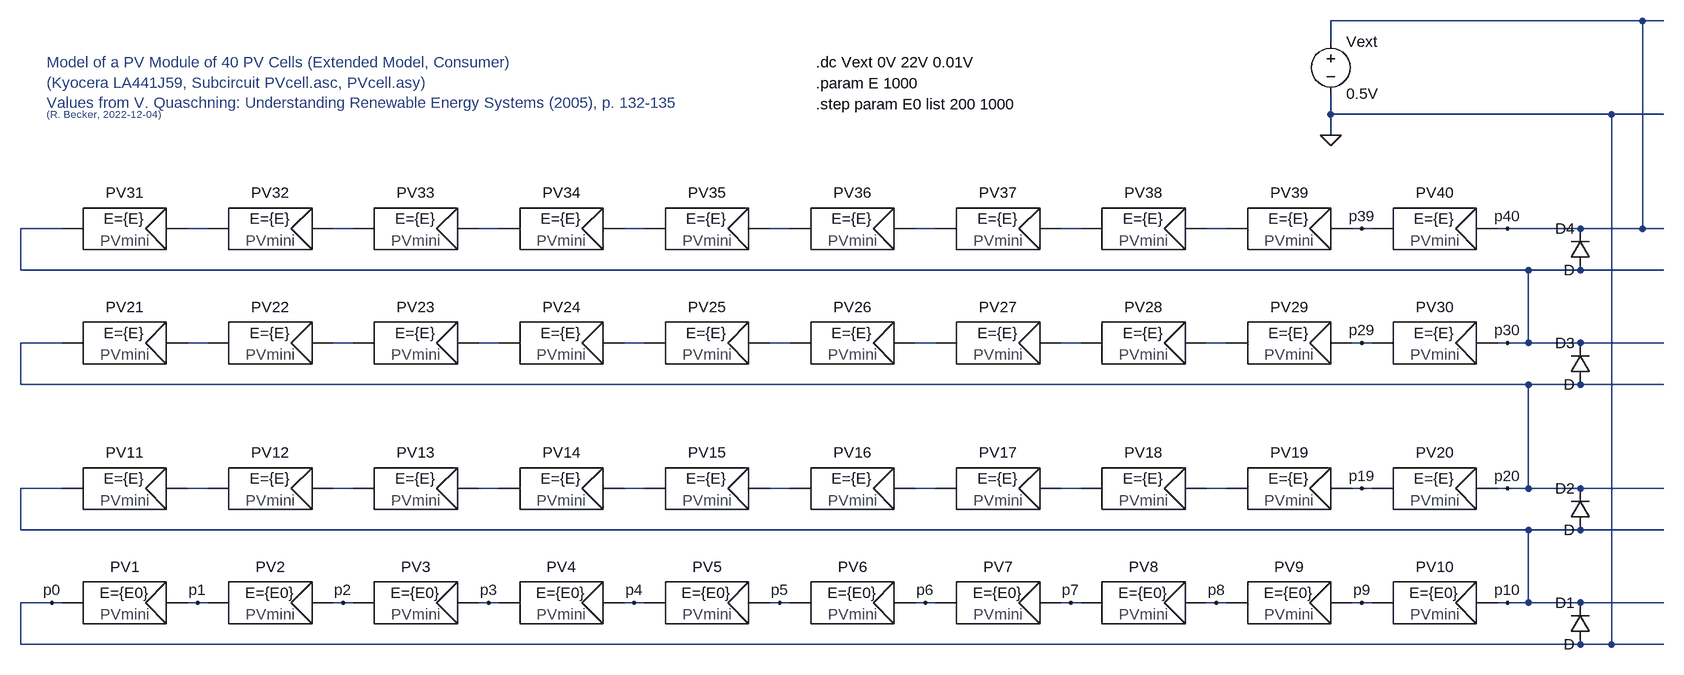
[diagram p0: schematic PVmodule_40_PVcell_Ext_Mini_V002.asc]
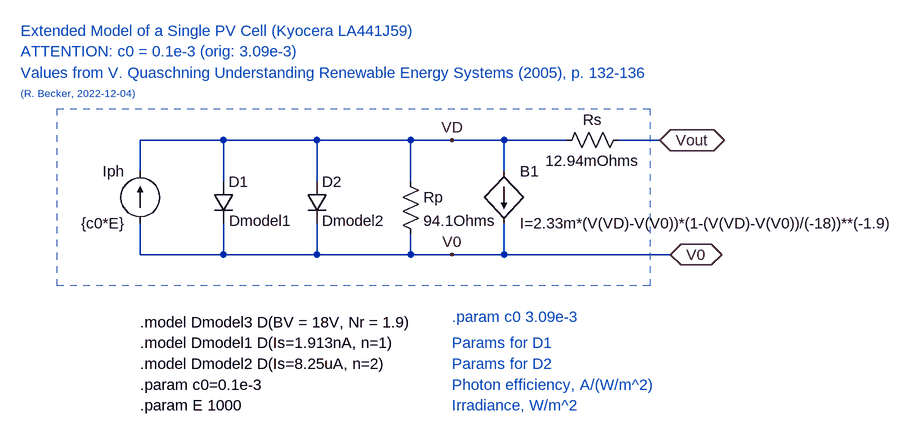
[diagram p1: sub-circuit pvcell_ext_mini.asc]
PVmodule_40_PVcell_Ext_Mini_V002.asc, the LTspice schematic file:
Version 4
SHEET 1 2048 1588
WIRE 1920 -16 1440 -16
WIRE 1952 -16 1920 -16
WIRE 1440 16 1440 -16
WIRE 1440 128 1440 96
WIRE 1872 128 1440 128
WIRE 1952 128 1872 128
WIRE 1440 160 1440 128
WIRE -512 304 -576 304
WIRE -288 304 -320 304
WIRE -64 304 -96 304
WIRE 160 304 128 304
WIRE 384 304 352 304
WIRE 608 304 576 304
WIRE 832 304 800 304
WIRE 1056 304 1024 304
WIRE 1280 304 1248 304
WIRE 1488 304 1472 304
WIRE 1504 304 1488 304
WIRE 1712 304 1696 304
WIRE 1824 304 1712 304
WIRE 1920 304 1920 -16
WIRE 1920 304 1824 304
WIRE 1952 304 1920 304
WIRE -576 368 -576 304
WIRE 1744 368 -576 368
WIRE 1824 368 1744 368
WIRE 1952 368 1824 368
WIRE -512 480 -576 480
WIRE -288 480 -320 480
WIRE -64 480 -96 480
WIRE 160 480 128 480
WIRE 384 480 352 480
WIRE 608 480 576 480
WIRE 832 480 800 480
WIRE 1056 480 1024 480
WIRE 1280 480 1248 480
WIRE 1488 480 1472 480
WIRE 1504 480 1488 480
WIRE 1712 480 1696 480
WIRE 1744 480 1744 368
WIRE 1744 480 1712 480
WIRE 1824 480 1744 480
WIRE 1952 480 1824 480
WIRE -576 544 -576 480
WIRE 1744 544 -576 544
WIRE 1824 544 1744 544
WIRE 1952 544 1824 544
WIRE -512 704 -576 704
WIRE -288 704 -320 704
WIRE -64 704 -96 704
WIRE 160 704 128 704
WIRE 384 704 352 704
WIRE 608 704 576 704
WIRE 832 704 800 704
WIRE 1056 704 1024 704
WIRE 1280 704 1248 704
WIRE 1488 704 1472 704
WIRE 1504 704 1488 704
WIRE 1712 704 1696 704
WIRE 1744 704 1744 544
WIRE 1744 704 1712 704
WIRE 1824 704 1744 704
WIRE 1952 704 1824 704
WIRE -576 768 -576 704
WIRE 1744 768 -576 768
WIRE 1824 768 1744 768
WIRE 1952 768 1824 768
WIRE -528 880 -576 880
WIRE -512 880 -528 880
WIRE -304 880 -320 880
WIRE -288 880 -304 880
WIRE -80 880 -96 880
WIRE -64 880 -80 880
WIRE 144 880 128 880
WIRE 160 880 144 880
WIRE 368 880 352 880
WIRE 384 880 368 880
WIRE 592 880 576 880
WIRE 608 880 592 880
WIRE 816 880 800 880
WIRE 832 880 816 880
WIRE 1040 880 1024 880
WIRE 1056 880 1040 880
WIRE 1264 880 1248 880
WIRE 1280 880 1264 880
WIRE 1488 880 1472 880
WIRE 1504 880 1488 880
WIRE 1712 880 1696 880
WIRE 1744 880 1744 768
WIRE 1744 880 1712 880
WIRE 1824 880 1744 880
WIRE 1952 880 1824 880
WIRE -576 944 -576 880
WIRE 1824 944 -576 944
WIRE 1872 944 1872 128
WIRE 1872 944 1824 944
WIRE 1952 944 1872 944
FLAG 1440 160 0
FLAG -528 880 p0
FLAG -304 880 p1
FLAG -80 880 p2
FLAG 144 880 p3
FLAG 368 880 p4
FLAG 592 880 p5
FLAG 816 880 p6
FLAG 1040 880 p7
FLAG 1264 880 p8
FLAG 1488 880 p9
FLAG 1712 880 p10
FLAG 1488 704 p19
FLAG 1712 704 p20
FLAG 1712 480 p30
FLAG 1712 304 p40
FLAG 1488 480 p29
FLAG 1488 304 p39
SYMBOL voltage 1440 0 R0
WINDOW 123 0 0 Left 2
WINDOW 39 0 0 Left 2
SYMATTR InstName Vext
SYMATTR Value 0.5V
SYMBOL diode 1840 944 R180
WINDOW 0 24 64 Left 2
WINDOW 3 24 0 Left 2
SYMATTR InstName D1
SYMBOL diode 1840 768 R180
WINDOW 0 24 64 Left 2
WINDOW 3 24 0 Left 2
SYMATTR InstName D2
SYMBOL diode 1840 544 R180
WINDOW 0 24 64 Left 2
WINDOW 3 24 0 Left 2
SYMATTR InstName D3
SYMBOL diode 1840 368 R180
WINDOW 0 24 64 Left 2
WINDOW 3 24 0 Left 2
SYMATTR InstName D4
SYMBOL pvcell_ext_mini -416 880 R0
WINDOW 39 -1 0 Bottom 2
SYMATTR SpiceLine E={E0}
SYMATTR InstName PV1
SYMBOL pvcell_ext_mini -192 880 R0
WINDOW 39 -1 0 Bottom 2
SYMATTR SpiceLine E={E0}
SYMATTR InstName PV2
SYMBOL pvcell_ext_mini 32 880 R0
WINDOW 39 -1 0 Bottom 2
SYMATTR SpiceLine E={E0}
SYMATTR InstName PV3
SYMBOL pvcell_ext_mini 256 880 R0
WINDOW 39 -1 0 Bottom 2
SYMATTR SpiceLine E={E0}
SYMATTR InstName PV4
SYMBOL pvcell_ext_mini 480 880 R0
WINDOW 39 -1 0 Bottom 2
SYMATTR SpiceLine E={E0}
SYMATTR InstName PV5
SYMBOL pvcell_ext_mini 704 880 R0
WINDOW 39 -1 0 Bottom 2
SYMATTR SpiceLine E={E0}
SYMATTR InstName PV6
SYMBOL pvcell_ext_mini 928 880 R0
WINDOW 39 -1 0 Bottom 2
SYMATTR SpiceLine E={E0}
SYMATTR InstName PV7
SYMBOL pvcell_ext_mini 1152 880 R0
WINDOW 39 -1 0 Bottom 2
SYMATTR SpiceLine E={E0}
SYMATTR InstName PV8
SYMBOL pvcell_ext_mini 1376 880 R0
WINDOW 39 -1 0 Bottom 2
SYMATTR SpiceLine E={E0}
SYMATTR InstName PV9
SYMBOL pvcell_ext_mini 1600 880 R0
WINDOW 39 -1 0 Bottom 2
SYMATTR SpiceLine E={E0}
SYMATTR InstName PV10
SYMBOL pvcell_ext_mini -416 704 R0
WINDOW 39 -1 0 Bottom 2
SYMATTR SpiceLine E={E}
SYMATTR InstName PV11
SYMBOL pvcell_ext_mini -192 704 R0
WINDOW 39 -1 0 Bottom 2
SYMATTR SpiceLine E={E}
SYMATTR InstName PV12
SYMBOL pvcell_ext_mini 32 704 R0
WINDOW 39 -1 0 Bottom 2
SYMATTR SpiceLine E={E}
SYMATTR InstName PV13
SYMBOL pvcell_ext_mini 256 704 R0
WINDOW 39 -1 0 Bottom 2
SYMATTR SpiceLine E={E}
SYMATTR InstName PV14
SYMBOL pvcell_ext_mini 480 704 R0
WINDOW 39 -1 0 Bottom 2
SYMATTR SpiceLine E={E}
SYMATTR InstName PV15
SYMBOL pvcell_ext_mini 704 704 R0
WINDOW 39 -1 0 Bottom 2
SYMATTR SpiceLine E={E}
SYMATTR InstName PV16
SYMBOL pvcell_ext_mini 928 704 R0
WINDOW 39 -1 0 Bottom 2
SYMATTR SpiceLine E={E}
SYMATTR InstName PV17
SYMBOL pvcell_ext_mini 1152 704 R0
WINDOW 39 -1 0 Bottom 2
SYMATTR SpiceLine E={E}
SYMATTR InstName PV18
SYMBOL pvcell_ext_mini 1376 704 R0
WINDOW 39 -1 0 Bottom 2
SYMATTR SpiceLine E={E}
SYMATTR InstName PV19
SYMBOL pvcell_ext_mini 1600 704 R0
WINDOW 39 -1 0 Bottom 2
SYMATTR SpiceLine E={E}
SYMATTR InstName PV20
SYMBOL pvcell_ext_mini -416 480 R0
WINDOW 39 -1 0 Bottom 2
SYMATTR SpiceLine E={E}
SYMATTR InstName PV21
SYMBOL pvcell_ext_mini -192 480 R0
WINDOW 39 -1 0 Bottom 2
SYMATTR SpiceLine E={E}
SYMATTR InstName PV22
SYMBOL pvcell_ext_mini 32 480 R0
WINDOW 39 -1 0 Bottom 2
SYMATTR SpiceLine E={E}
SYMATTR InstName PV23
SYMBOL pvcell_ext_mini 256 480 R0
WINDOW 39 -1 0 Bottom 2
SYMATTR SpiceLine E={E}
SYMATTR InstName PV24
SYMBOL pvcell_ext_mini 480 480 R0
WINDOW 39 -1 0 Bottom 2
SYMATTR SpiceLine E={E}
SYMATTR InstName PV25
SYMBOL pvcell_ext_mini 704 480 R0
WINDOW 39 -1 0 Bottom 2
SYMATTR SpiceLine E={E}
SYMATTR InstName PV26
SYMBOL pvcell_ext_mini 928 480 R0
WINDOW 39 -1 0 Bottom 2
SYMATTR SpiceLine E={E}
SYMATTR InstName PV27
SYMBOL pvcell_ext_mini 1152 480 R0
WINDOW 39 -1 0 Bottom 2
SYMATTR SpiceLine E={E}
SYMATTR InstName PV28
SYMBOL pvcell_ext_mini 1376 480 R0
WINDOW 39 -1 0 Bottom 2
SYMATTR SpiceLine E={E}
SYMATTR InstName PV29
SYMBOL pvcell_ext_mini 1600 480 R0
WINDOW 39 -1 0 Bottom 2
SYMATTR SpiceLine E={E}
SYMATTR InstName PV30
SYMBOL pvcell_ext_mini -416 304 R0
WINDOW 39 -1 0 Bottom 2
SYMATTR SpiceLine E={E}
SYMATTR InstName PV31
SYMBOL pvcell_ext_mini -192 304 R0
WINDOW 39 -1 0 Bottom 2
SYMATTR SpiceLine E={E}
SYMATTR InstName PV32
SYMBOL pvcell_ext_mini 32 304 R0
WINDOW 39 -1 0 Bottom 2
SYMATTR SpiceLine E={E}
SYMATTR InstName PV33
SYMBOL pvcell_ext_mini 256 304 R0
WINDOW 39 -1 0 Bottom 2
SYMATTR SpiceLine E={E}
SYMATTR InstName PV34
SYMBOL pvcell_ext_mini 480 304 R0
WINDOW 39 -1 0 Bottom 2
SYMATTR SpiceLine E={E}
SYMATTR InstName PV35
SYMBOL pvcell_ext_mini 704 304 R0
WINDOW 39 -1 0 Bottom 2
SYMATTR SpiceLine E={E}
SYMATTR InstName PV36
SYMBOL pvcell_ext_mini 928 304 R0
WINDOW 39 -1 0 Bottom 2
SYMATTR SpiceLine E={E}
SYMATTR InstName PV37
SYMBOL pvcell_ext_mini 1152 304 R0
WINDOW 39 -1 0 Bottom 2
SYMATTR SpiceLine E={E}
SYMATTR InstName PV38
SYMBOL pvcell_ext_mini 1376 304 R0
WINDOW 39 -1 0 Bottom 2
SYMATTR SpiceLine E={E}
SYMATTR InstName PV39
SYMBOL pvcell_ext_mini 1600 304 R0
WINDOW 39 -1 0 Bottom 2
SYMATTR SpiceLine E={E}
SYMATTR InstName PV40
TEXT 648 48 Left 2 !.dc Vext 0V 22V 0.01V
TEXT 648 112 Left 2 !.step param E0 list 200 1000
TEXT -536 48 Left 2 ;Model of a PV Module of 40 PV Cells (Extended Model, Consumer) \n(Kyocera LA441J59, Subcircuit PVcell.asc, PVcell.asy)\nValues from V. Quaschning: Understanding Renewable Energy Systems (2005), p. 132-135
TEXT -536 128 Left 1 ;(R. Becker, 2022-12-04)
TEXT 648 80 Left 2 !.param E 1000

pvcell_ext_mini.asc, the sub-circuit schematic file:
Version 4
SHEET 1 1164 680
WIRE 0 32 -128 32
WIRE 144 32 0 32
WIRE 288 32 144 32
WIRE 352 32 288 32
WIRE 432 32 352 32
WIRE 528 32 432 32
WIRE 672 32 608 32
WIRE -128 80 -128 32
WIRE 432 80 432 32
WIRE 0 96 0 32
WIRE 144 96 144 32
WIRE 288 96 288 32
WIRE -128 208 -128 160
WIRE 0 208 0 160
WIRE 0 208 -128 208
WIRE 144 208 144 160
WIRE 144 208 0 208
WIRE 288 208 288 176
WIRE 288 208 144 208
WIRE 352 208 288 208
WIRE 432 208 432 160
WIRE 432 208 352 208
WIRE 688 208 432 208
FLAG 672 32 Vout
IOPIN 672 32 BiDir
FLAG 688 208 V0
IOPIN 688 208 BiDir
FLAG 352 32 VD
FLAG 352 208 V0
SYMBOL diode -16 96 R0
WINDOW 3 25 60 Left 2
SYMATTR Value Dmodel1
SYMATTR InstName D1
SYMBOL current -128 160 R180
WINDOW 0 24 80 Left 2
WINDOW 3 24 0 Left 2
SYMATTR InstName Iph
SYMATTR Value {c0*E}
SYMBOL diode 128 96 R0
WINDOW 3 24 60 Left 2
SYMATTR Value Dmodel2
SYMATTR InstName D2
SYMBOL res 272 80 R0
SYMATTR InstName Rp
SYMATTR Value 94.1Ohms
SYMBOL res 624 16 R90
WINDOW 0 0 56 VBottom 2
WINDOW 3 32 56 VTop 2
SYMATTR InstName Rs
SYMATTR Value 12.94mOhms
SYMBOL bi 432 80 R0
SYMATTR InstName B1
SYMATTR Value I=2.33m*(V(VD)-V(V0))*(1-(V(VD)-V(V0))/(-18))**(-1.9)
TEXT -128 344 Left 2 !.model Dmodel1 D(Is=1.913nA, n=1)
TEXT -128 376 Left 2 !.model Dmodel2 D(Is=8.25uA, n=2)
TEXT -128 408 Left 2 !.param c0=0.1e-3
TEXT -312 -72 Left 2 ;Values from V. Quaschning Understanding Renewable Energy Systems (2005), p. 132-136
TEXT -312 -136 Left 2 ;Extended Model of a Single PV Cell (Kyocera LA441J59)\nATTENTION: c0 = 0.1e-3 (orig: 3.09e-3)
TEXT -312 -40 Left 1 ;(R. Becker, 2022-12-04)
TEXT -128 440 Left 2 !.param E 1000
TEXT 352 440 Left 2 ;Irradiance, W/m^2
TEXT 352 408 Left 2 ;Photon efficiency, A/(W/m^2)
TEXT 352 344 Left 2 ;Params for D1
TEXT 352 376 Left 2 ;Params for D2
TEXT -128 312 Left 2 !.model Dmodel3 D(BV = 18V, Nr = 1.9)
TEXT 352 304 Left 2 ;.param c0 3.09e-3
RECTANGLE Normal 656 256 -256 -16 1

The netlist it stands for:
* PVmodule_40_PVcell_Ext_Mini_V002.asc
Vext p40 0 0.5V
D1 0 p10 D
D2 p10 p20 D
D3 p20 p30 D
D4 p30 p40 D
XPV1 0 p1 pvcell_ext_mini params: E={E0}
XPV2 p1 p2 pvcell_ext_mini params: E={E0}
XPV3 p2 p3 pvcell_ext_mini params: E={E0}
XPV4 p3 p4 pvcell_ext_mini params: E={E0}
XPV5 p4 p5 pvcell_ext_mini params: E={E0}
XPV6 p5 p6 pvcell_ext_mini params: E={E0}
XPV7 p6 p7 pvcell_ext_mini params: E={E0}
XPV8 p7 p8 pvcell_ext_mini params: E={E0}
XPV9 p8 p9 pvcell_ext_mini params: E={E0}
XPV10 p9 p10 pvcell_ext_mini params: E={E0}
XPV11 p10 N017 pvcell_ext_mini params: E={E}
XPV12 N017 N018 pvcell_ext_mini params: E={E}
XPV13 N018 N019 pvcell_ext_mini params: E={E}
XPV14 N019 N020 pvcell_ext_mini params: E={E}
XPV15 N020 N021 pvcell_ext_mini params: E={E}
XPV16 N021 N022 pvcell_ext_mini params: E={E}
XPV17 N022 N023 pvcell_ext_mini params: E={E}
XPV18 N023 N024 pvcell_ext_mini params: E={E}
XPV19 N024 p19 pvcell_ext_mini params: E={E}
XPV20 p19 p20 pvcell_ext_mini params: E={E}
XPV21 p20 N009 pvcell_ext_mini params: E={E}
XPV22 N009 N010 pvcell_ext_mini params: E={E}
XPV23 N010 N011 pvcell_ext_mini params: E={E}
XPV24 N011 N012 pvcell_ext_mini params: E={E}
XPV25 N012 N013 pvcell_ext_mini params: E={E}
XPV26 N013 N014 pvcell_ext_mini params: E={E}
XPV27 N014 N015 pvcell_ext_mini params: E={E}
XPV28 N015 N016 pvcell_ext_mini params: E={E}
XPV29 N016 p29 pvcell_ext_mini params: E={E}
XPV30 p29 p30 pvcell_ext_mini params: E={E}
XPV31 p30 N001 pvcell_ext_mini params: E={E}
XPV32 N001 N002 pvcell_ext_mini params: E={E}
XPV33 N002 N003 pvcell_ext_mini params: E={E}
XPV34 N003 N004 pvcell_ext_mini params: E={E}
XPV35 N004 N005 pvcell_ext_mini params: E={E}
XPV36 N005 N006 pvcell_ext_mini params: E={E}
XPV37 N006 N007 pvcell_ext_mini params: E={E}
XPV38 N007 N008 pvcell_ext_mini params: E={E}
XPV39 N008 p39 pvcell_ext_mini params: E={E}
XPV40 p39 p40 pvcell_ext_mini params: E={E}

* block symbol definitions
.subckt pvcell_ext_mini V0 Vout
D1 VD V0 Dmodel1
Iph V0 VD {c0*E}
D2 VD V0 Dmodel2
Rp VD V0 94.1Ohms
Rs Vout VD 12.94mOhms
B1 VD V0 I=2.33m*(V(VD)-V(V0))*(1-(V(VD)-V(V0))/(-18))**(-1.9)
.model Dmodel1 D(Is=1.913nA, n=1)
.model Dmodel2 D(Is=8.25uA, n=2)
.param c0=0.1e-3
* Values from V. Quaschning Understanding Renewable Energy Systems (2005), p. 132-136
* Extended Model of a Single PV Cell (Kyocera LA441J59)
* ATTENTION: c0 = 0.1e-3 (orig: 3.09e-3)
* (R. Becker, 2022-12-04)
.param E 1000
* Irradiance, W/m^2
* Photon efficiency, A/(W/m^2)
* Params for D1
* Params for D2
.model Dmodel3 D(BV = 18V, Nr = 1.9)
* .param c0 3.09e-3
.ends pvcell_ext_mini

.model D D
.lib standard.dio
.dc Vext 0V 22V 0.01V
.step param E0 list 200 1000
* Model of a PV Module of 40 PV Cells (Extended Model, Consumer)
* (Kyocera LA441J59, Subcircuit PVcell.asc, PVcell.asy)
* Values from V. Quaschning: Understanding Renewable Energy Systems (2005), p. 132-135
* (R. Becker, 2022-12-04)
.param E 1000
.backanno
.end